# EAGLE design MainBoardR5 (EAGLE 6.5.0)
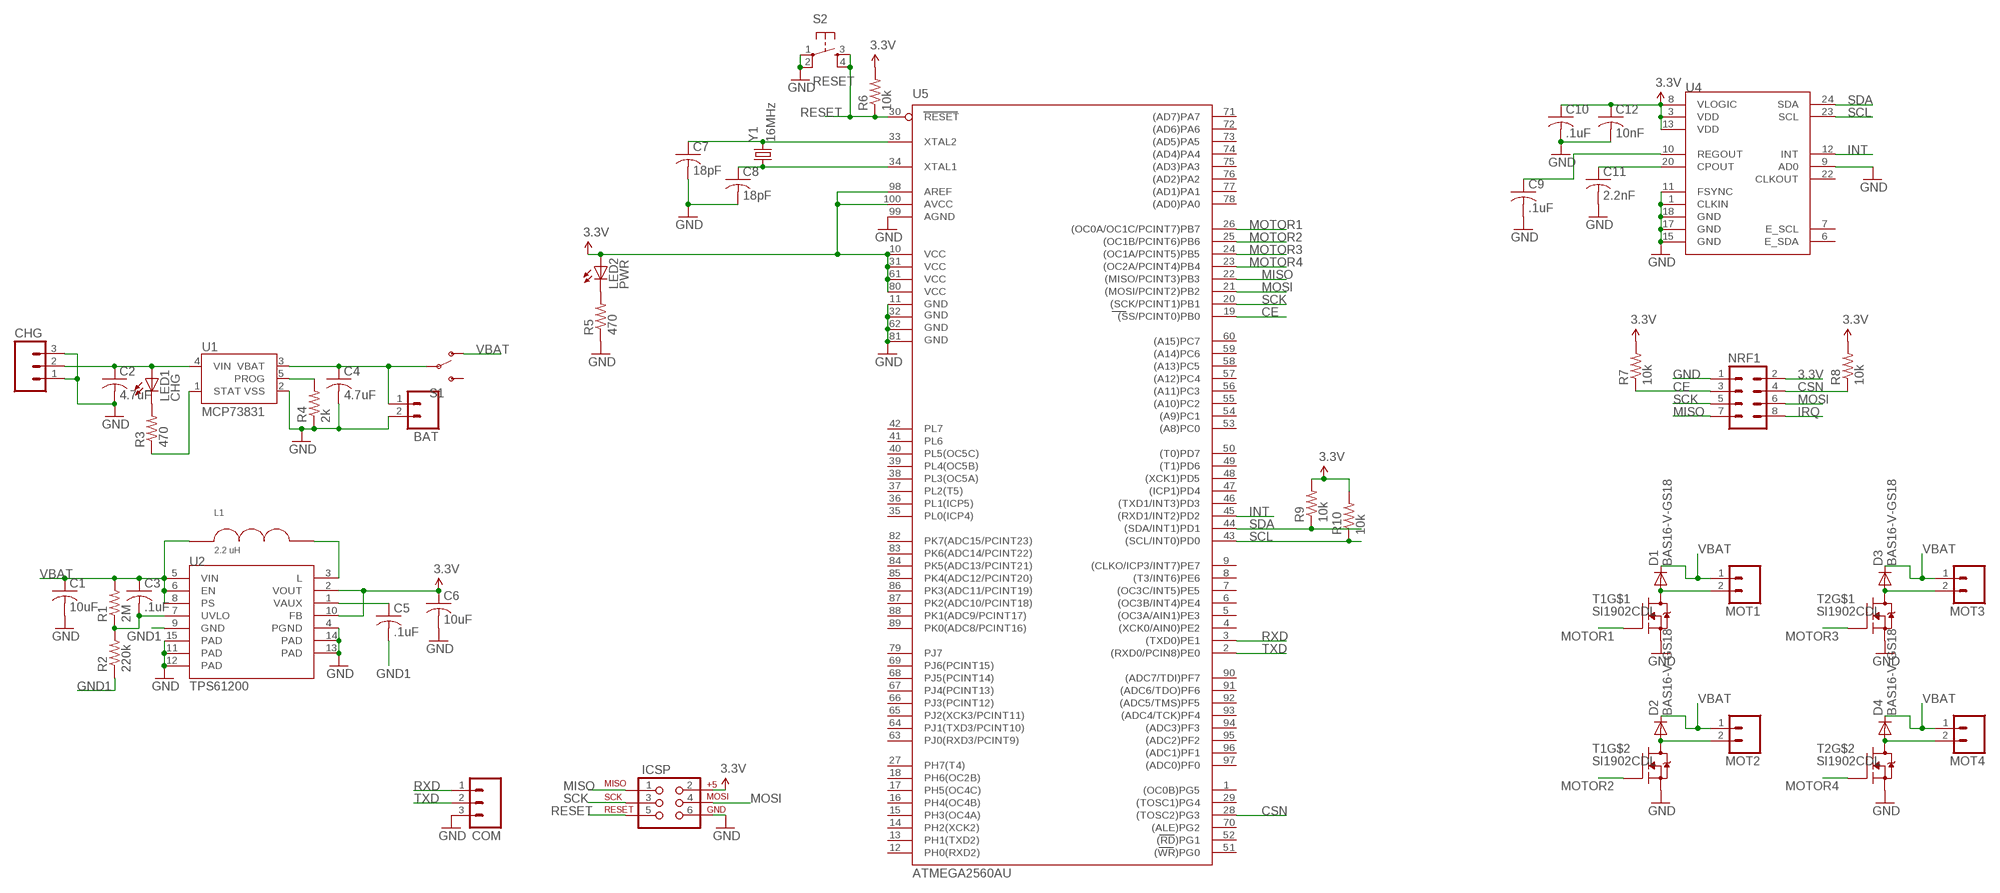
[diagram p0: schematic, sheet 1]

## Parts
BAT  M02LOCK_LONGPADS  [1X02_LOCK_LONGPADS]
C1  10uF  C-USC0805  [C0805]
C2  4.7uF  C-USC0805  [C0805]
C3  .1uF  C-USC0805  [C0805]
C4  4.7uF  C-USC0805  [C0805]
C5  .1uF  C-USC0805  [C0805]
C6  10uF  C-USC0805  [C0805]
C7  18pF  C-USC0805  [C0805]
C8  18pF  C-USC0805  [C0805]
C9  .1uF  C-USC0805  [C0805]
C10  .1uF  C-USC0805  [C0805]
C11  2.2nF  C-USC0805  [C0805]
C12  10nF  C-USC0805  [C0805]
CHG  M03LONGPADS  [1X03_LONGPADS]
COM  M03LONGPADS  [1X03_LONGPADS]
D1  BAS16-V-GS18  [SOT23]
D2  BAS16-V-GS18  [SOT23]
D3  BAS16-V-GS18  [SOT23]
D4  BAS16-V-GS18  [SOT23]
ICSP  AVR_SPI_PRG_62X3_LOCK  [2X3_LOCK]
L1  2.2 uH  BRHL2518T2R2M  [2518]
LED1  CHG  LED1206  [LED-1206]
LED2  PWR  LED1206  [LED-1206]
MOT1  M02LOCK_LONGPADS  [1X02_LOCK_LONGPADS]
MOT2  M02LOCK_LONGPADS  [1X02_LOCK_LONGPADS]
MOT3  M02LOCK_LONGPADS  [1X02_LOCK_LONGPADS]
MOT4  M02LOCK_LONGPADS  [1X02_LOCK_LONGPADS]
NRF1  M04X2  [2X4]
R1  2M  RESISTOR0805-RES  [0805]
R2  220k  RESISTOR0805-RES  [0805]
R3  470  RESISTOR0805-RES  [0805]
R4  2k  RESISTOR0805-RES  [0805]
R5  470  RESISTOR0805-RES  [0805]
R6  10k  RESISTOR0805-RES  [0805]
R7  10k  RESISTOR0805-RES  [0805]
R8  10k  RESISTOR0805-RES  [0805]
R9  10k  RESISTOR0805-RES  [0805]
R10  10k  RESISTOR0805-RES  [0805]
S1  SWITCH-SPST-SMD-A  [SWITCH-SPST-SMD-A]
S2  RESET  TAC_SWITCHSMD  [TACTILE_SWITCH_SMD]
T1  SI1902CDL  [SOT363_INFINEON]
T2  SI1902CDL  [SOT363_INFINEON]
U1  MCP73831  [SOT23-5]
U2  TPS61200  [QFN-10_PAD]
U4  MPU-9150QFN-24-NP  [QFN-24-NP]
U5  ATMEGA2560AU  [TQFP100]
Y1  16MHz  CRYSTAL5X3  [CRYSTAL-SMD-5X3]

## Nets
3.3V: C6.1 C10.1 C12.1 ICSP.2 LED2.A NRF1.2 R6.2 R7.2 R8.2 R9.2 R10.2 U2.2(VOUT) U2.10(FB) U4.3(VDD) U4.8(VLOGIC) U4.13(VDD) U5.10(VCC) U5.31(VCC1) U5.61(VCC2) U5.80(VCC3) U5.98(AREF) U5.100(AVCC)
BAT+: BAT.1 C4.1 S1.2(P) U1.3(VBAT)
CE: NRF1.3 R7.1 U5.19((SS/PCINT0)PB0)
CSN: NRF1.4 R8.1 U5.28((TOSC2)PG3)
GND: BAT.2 C1.2 C2.2 C4.2 C6.2 C7.2 C8.2 C9.2 C10.2 C11.2 C12.2 CHG.1 CHG.3 COM.3 ICSP.6 NRF1.1 R4.1 R5.1 S2.1 S2.2 T1.1(S) T1.4(S) T2.1(S) T2.4(S) U1.2(VSS) U2.4(PGND) U2.11(PAD) U2.12(PAD) U2.13(PAD) U2.14(PAD) U2.15(PAD) U4.1(CLKIN) U4.9(AD0) U4.11(FSYNC) U4.15(GND) U4.17(GND) U4.18(GND) U5.11(GND) U5.32(GND1) U5.62(GND2) U5.81(GND3) U5.99(AGND)
GND1: C5.2 R2.1 U2.9(GND)
INT: U4.12(INT) U5.45((RXD1/INT2)PD2)
IRQ: NRF1.8
MISO: ICSP.1 NRF1.7 U5.22((MISO/PCINT3)PB3)
MOSI: ICSP.4 NRF1.6 U5.21((MOSI/PCINT2)PB2)
MOT1-: D1.1(A) MOT1.2 T1.6(D)
MOT2-: D2.1(A) MOT2.2 T1.3(D)
MOT3-: D3.1(A) MOT3.2 T2.6(D)
MOT4-: D4.1(A) MOT4.2 T2.3(D)
MOTOR1: T1.2(G) U5.26((OC0A/OC1C/PCINT7)PB7)
MOTOR2: T1.5(G) U5.25((OC1B/PCINT6)PB6)
MOTOR3: T2.2(G) U5.24((OC1A/PCINT5)PB5)
MOTOR4: T2.5(G) U5.23((OC2A/PCINT4)PB4)
N$2: C7.1 U5.33(XTAL2) Y1.3
N$3: C8.1 U5.34(XTAL1) Y1.1
N$4: C11.1 U4.20(CPOUT)
N$5: LED1.C R3.2
N$9: C9.1 U4.10(REGOUT)
N$10: R3.1 U1.1(STAT)
N$12: R4.2 U1.5(PROG)
N$13: C5.1 U2.1(VAUX)
N$14: C3.2 R1.1 R2.2 U2.7(UVLO)
N$15: LED2.C R5.2
N$16: L1.P$2 U2.3(L)
RESET: ICSP.5 R6.1 S2.3 S2.4 U5.30(RESET)
RXD: COM.1 U5.3((TXD0)PE1)
SCK: ICSP.3 NRF1.5 U5.20((SCK/PCINT1)PB1)
SCL: R10.1 U4.23(SCL) U5.43((SCL/INT0)PD0)
SDA: R9.1 U4.24(SDA) U5.44((SDA/INT1)PD1)
TXD: COM.2 U5.2((RXD0/PCIN8)PE0)
VBAT: C1.1 C3.1 D1.3(C) D2.3(C) D3.3(C) D4.3(C) L1.P$1 MOT1.1 MOT2.1 MOT3.1 MOT4.1 R1.2 S1.1(O) U2.5(VIN) U2.6(EN) U2.8(PS)
VIN: C2.1 CHG.2 LED1.A U1.4(VIN)
Unconnected: S1.3(S) U4.6(E_SDA) U4.7(E_SCL) U4.22(CLKOUT) U5.1((OC0B)PG5) U5.4((XCK0/AIN0)PE2) U5.5((OC3A/AIN1)PE3) U5.6((OC3B/INT4)PE4) U5.7((OC3C/INT5)PE5) U5.8((T3/INT6)PE6) U5.9((CLKO/ICP3/INT7)PE7) U5.12(PH0(RXD2)) U5.13(PH1(TXD2)) U5.14(PH2(XCK2)) U5.15(PH3(OC4A)) U5.16(PH4(OC4B)) U5.17(PH5(OC4C)) U5.18(PH6(OC2B)) U5.27(PH7(T4)) U5.29((TOSC1)PG4) U5.35(PL0(ICP4)) U5.36(PL1(ICP5)) U5.37(PL2(T5)) U5.38(PL3(OC5A)) U5.39(PL4(OC5B)) U5.40(PL5(OC5C)) U5.41(PL6) U5.42(PL7) U5.46((TXD1/INT3)PD3) U5.47((ICP1)PD4) U5.48((XCK1)PD5) U5.49((T1)PD6) U5.50((T0)PD7) U5.51((WR)PG0) U5.52((RD)PG1) U5.53((A8)PC0) U5.54((A9)PC1) U5.55((A10)PC2) U5.56((A11)PC3) U5.57((A12)PC4) U5.58((A13)PC5) U5.59((A14)PC6) U5.60((A15)PC7) U5.63(PJ0(RXD3/PCINT9)) U5.64(PJ1(TXD3/PCINT10)) U5.65(PJ2(XCK3/PCINT11)) U5.66(PJ3(PCINT12)) U5.67(PJ4(PCINT13)) U5.68(PJ5(PCINT14)) U5.69(PJ6(PCINT15)) U5.70((ALE)PG2) U5.71((AD7)PA7) U5.72((AD6)PA6) U5.73((AD5)PA5) U5.74((AD4)PA4) U5.75((AD3)PA3) U5.76((AD2)PA2) U5.77((AD1)PA1) U5.78((AD0)PA0) U5.79(PJ7) U5.82(PK7(ADC15/PCINT23)) U5.83(PK6(ADC14/PCINT22)) U5.84(PK5(ADC13/PCINT21)) U5.85(PK4(ADC12/PCINT20)) U5.86(PK3(ADC11/PCINT19)) U5.87(PK2(ADC10/PCINT18)) U5.88(PK1(ADC9/PCINT17)) U5.89(PK0(ADC8/PCINT16)) U5.90((ADC7/TDI)PF7) U5.91((ADC6/TDO)PF6) U5.92((ADC5/TMS)PF5) U5.93((ADC4/TCK)PF4) U5.94((ADC3)PF3) U5.95((ADC2)PF2) U5.96((ADC1)PF1) U5.97((ADC0)PF0)

## Library data of the parts
BAT MOT1-MOT4 = SparkFun:M02: Header 2 Standard 2-pin 0.1" header. Use with straight break away headers (SKU : PRT-00116), right angle break away headers (PRT-00553), swiss pins (PRT-00743), machine pins (PRT-00117), and female headers (PRT-00115). Molex polarized connector foot print use with SKU : PRT-08233 with associated crimp pins and housings.
C1-C12 = rcl:C-US: CAPACITOR, American symbol
CHG COM = SparkFun:M03: Header 3 Standard 3-pin 0.1" header. Use with straight break away headers (SKU : PRT-00116), right angle break away headers (PRT-00553), swiss pins (PRT-00743), machine pins (PRT-00117), and female headers (PRT-00115). Molex polarized connector foot print use with SKU : PRT-08232 with associated crimp pins and housings.
D1-D4 = diode:BAS16-V-GS18
ICSP = SparkFun:AVR_SPI_PRG_6: AVR ISP 6 Pin This is the reduced ISP connector for AVR programming. Common on Arduino. This footprint will take up less PCB space and can be used with a 10-pin to 6-pin adapter such as SKU: BOB-08508
L1 = inductors:BRHL2518T2R2M
LED1 LED2 = SparkFun:LED: LEDs Standard schematic elements and footprints for 5mm, 3mm, 1206, and 0603 sized LEDs. 5mm - Spark Fun Electronics SKU : COM-00529 (and others)
NRF1 = SparkFun:M04X2
R1-R10 = SparkFun:RESISTOR: Resistor Basic schematic elements and footprints for 0603, 1206, and PTH resistors.
S1 = SparkFun:SWITCH-SPST: SPST Switch Simple slide switch. Spark Fun Electronics SKU : COM-00102
S2 = SparkFun:TAC_SWITCH: Momentary Switch Button commonly used for reset or general input. Spark Fun Electronics SKU : COM-00097
T1 T2 = transistor-fet:SI1902CDL
U1 = SparkFun:MCP73831: Microchip's MCP73831 Miniature single cell, fully integrated Li-Ion, Li-polymer charge management controller http://ww1.microchip.com/downloads/en/DeviceDoc/21984a.pdf
U2 = SparkFun:TPS61200: DC to DC Booster
U4 = SparkFun-Sensors:MPU-9150: 9DOF (3mag, 3accel, 3rotat). I2C interface.
U5 = SparkFun-DigitalIC:ATMEGA2560: Atmel 100-pin 8-bit uC 64/128/256 Kbytes FLASH 4 Kbytes EEPROM 8 Kbytes SRAM 86 General Purpose I/O pins 12-channels16-bit PWM 4 x Serial USARTs 16-channels 10-bit A/D
Y1 = SparkFun:CRYSTAL: Crystals Various standard crystals. Proven footprints. Spark Fun Electronics SKU : COM-00534

## Board
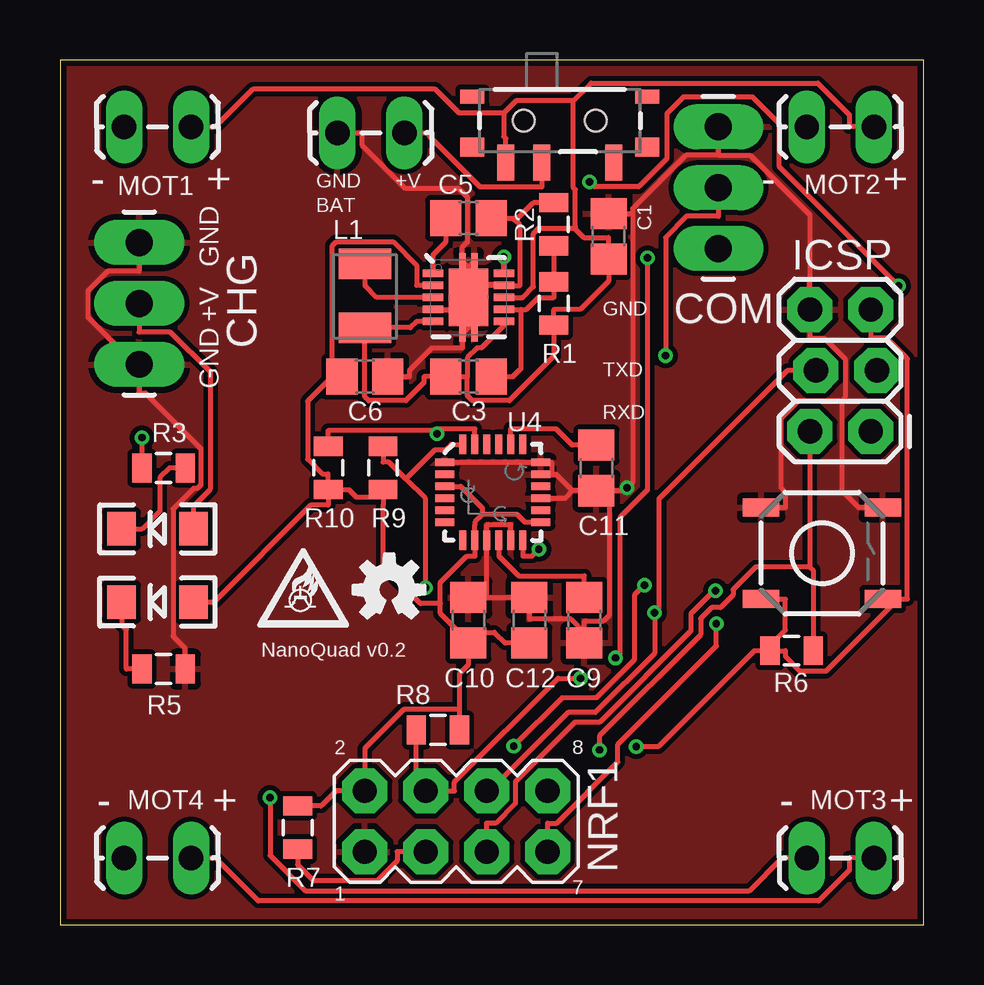
[diagram p1: board, top side]
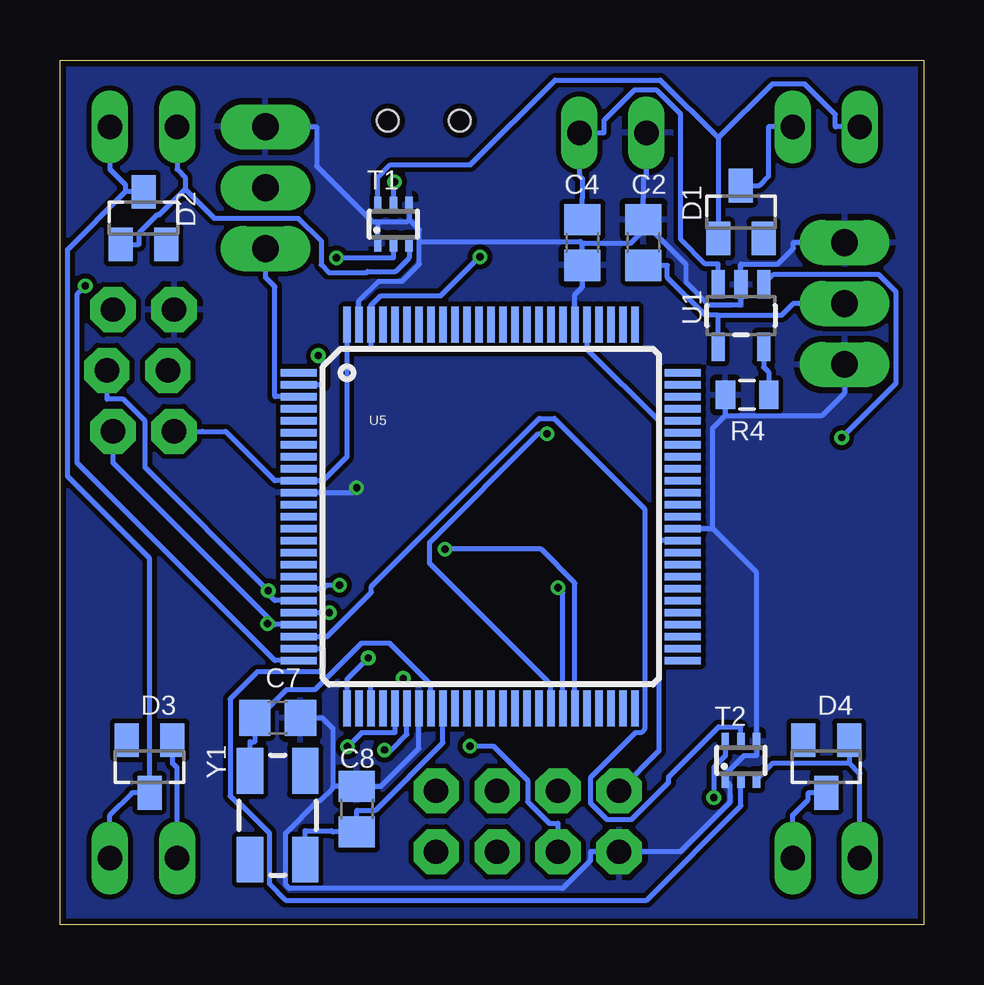
[diagram p2: board, bottom side, seen from below]

Size 35.99 x 36.06 mm. Coordinates in mm from the lower left corner, seen from the top.
Outline: 0,0 35.99,0 35.99,36.06 0,36.06 0,0
Copper layers (1*16): Top 0.035mm / dielectric 1.5mm / Bottom 0.035mm
Design rules "Fusion_eagle_rule_v1.1 *": minimum track width 8mil, minimum drill 12mil, track to track 8mil, track to pad 6mil, pad to pad 6mil, via to via 8mil, smd to smd 0mil, copper to edge 10mil, drill to drill 10mil, minimum pad ring 10mil, minimum via ring 6mil, stop-mask expansion 2mil, vias tented up to drill 100mil, thermal gap 10mil

### Footprints (pad centres in the part's own frame; a part is rotated, then mirrored left to right if it is on the bottom)
1X02_LOCK_LONGPADS = drill 1.016 long: 1 -0.127,0; 2 2.667,0
C0805 = smd 1.3 x 1.5: 1 -0.95,0; 2 0.95,0
1X03_LONGPADS = drill 1.118 pad 1.88 long: 1 0,0; 2 2.54,0; 3 5.08,0
SOT23 = smd 1 x 1.4: 1 -0.95,-1.1; 2 0.95,-1.1; 3 0,1.1
2X3_LOCK = drill 1.016 pad 1.88 octagon: 1 0,0; 2 0,2.54; 3 2.54,-0.254; 4 2.54,2.286; 5 5.08,0; 6 5.08,2.54
2518 = smd 1.27 x 2.184: P$1 -0.254,0; P$2 2.413,0
LED-1206 = smd 1.2 x 1.4: A -1.5,0; C 1.5,0
2X4 = drill 1.016 pad 1.88 octagon: 1 -3.81,-1.27; 2 -3.81,1.27; 3 -1.27,-1.27; 4 -1.27,1.27; 5 1.27,-1.27; 6 1.27,1.27; 7 3.81,-1.27; 8 3.81,1.27
0805 = smd 0.8 x 1.2: 1 -0.9,0; 2 0.9,0
SWITCH-SPST-SMD-A = smd 0.7 x 1.5: 1 -2.25,-1.75; 2 -0.75,-1.75; 3 2.25,-1.75 | smd 1 x 0.6: GND1 -3.65,1; GND3 3.65,1 | smd 1 x 0.8: GND2 -3.65,-1.1; GND4 3.65,-1.1 | hole 0.9: -1.5,0; 1.5,0
TACTILE_SWITCH_SMD = smd 1.524 x 0.762: 1 -2.54,1.905; 2 2.54,1.905; 3 -2.54,-1.905; 4 2.54,-1.905
SOT363_INFINEON = smd 0.3 x 0.7: 1 -0.65,-0.8; 2 0,-0.8; 3 0.65,-0.8; 4 0.65,0.8; 5 0,0.8; 6 -0.65,0.8
SOT23-5 = smd 0.55 x 1.2: 1 -0.95,-1.3; 2 0,-1.3; 3 0.95,-1.3; 4 0.95,1.3; 5 -0.95,1.3
QFN-10_PAD = smd 0.297 x 0.85: 1 -1,-1.475; 2 -0.5,-1.475; 3 0,-1.475; 4 0.5,-1.475; 5 1,-1.475; 6 1,1.475; 7 0.5,1.475; 8 0,1.475; 9 -0.5,1.475; 10 -1,1.475 | smd 0.7 x 0.28: 11 -1.5,0.25; 12 -1.5,-0.25; 13 1.5,0.25; 14 1.5,-0.25 | smd 2.4 x 1.65: 15 0,0
QFN-24-NP = smd 0.8 x 0.3: 1 -2,1.25; 2 -2,0.75; 3 -2,0.25; 4 -2,-0.25; 5 -2,-0.75; 6 -2,-1.25; 13 2,-1.25; 14 2,-0.75; 15 2,-0.25; 16 2,0.25; 17 2,0.75; 18 2,1.25 | smd 0.3 x 0.8: 7 -1.25,-2; 8 -0.75,-2; 9 -0.25,-2; 10 0.25,-2; 11 0.75,-2; 12 1.25,-2; 19 1.25,2; 20 0.75,2; 21 0.25,2; 22 -0.25,2; 23 -0.75,2; 24 -1.25,2
TQFP100 = smd 1.5 x 0.3: 1 -8,6; 2 -8,5.5; 3 -8,5; 4 -8,4.5; 5 -8,4; 6 -8,3.5; 7 -8,3; 8 -8,2.5; 9 -8,2; 10 -8,1.5; 11 -8,1; 12 -8,0.5; 13 -8,0; 14 -8,-0.5; 15 -8,-1; 16 -8,-1.5; 17 -8,-2; 18 -8,-2.5; 19 -8,-3; 20 -8,-3.5; 21 -8,-4; 22 -8,-4.5; 23 -8,-5; 24 -8,-5.5; 25 -8,-6; 51 8,-6; 52 8,-5.5; 53 8,-5; 54 8,-4.5; 55 8,-4; 56 8,-3.5; 57 8,-3; 58 8,-2.5; 59 8,-2; 60 8,-1.5; 61 8,-1; 62 8,-0.5; 63 8,0; 64 8,0.5; 65 8,1; 66 8,1.5; 67 8,2; 68 8,2.5; 69 8,3; 70 8,3.5; 71 8,4; 72 8,4.5; 73 8,5; 74 8,5.5; 75 8,6 | smd 0.3 x 1.5: 26 -6,-8; 27 -5.5,-8; 28 -5,-8; 29 -4.5,-8; 30 -4,-8; 31 -3.5,-8; 32 -3,-8; 33 -2.5,-8; 34 -2,-8; 35 -1.5,-8; 36 -1,-8; 37 -0.5,-8; 38 0,-8; 39 0.5,-8; 40 1,-8; 41 1.5,-8; 42 2,-8; 43 2.5,-8; 44 3,-8; 45 3.5,-8; 46 4,-8; 47 4.5,-8; 48 5,-8; 49 5.5,-8; 50 6,-8; 76 6,8; 77 5.5,8; 78 5,8; 79 4.5,8; 80 4,8; 81 3.5,8; 82 3,8; 83 2.5,8; 84 2,8; 85 1.5,8; 86 1,8; 87 0.5,8; 88 0,8; 89 -0.5,8; 90 -1,8; 91 -1.5,8; 92 -2,8; 93 -2.5,8; 94 -3,8; 95 -3.5,8; 96 -4,8; 97 -4.5,8; 98 -5,8; 99 -5.5,8; 100 -6,8
CRYSTAL-SMD-5X3 = smd 1.9 x 1.1: 1 -1.85,-1.15; 2 1.85,-1.15; 3 1.85,1.15; 4 -1.85,1.15

### Placement (x,y rotation side)
BAT  14.22,33.02 180 top
C1  22.86,28.7 90 top
C2  11.68,28.45 90 bottom
C3  17.02,22.86 0 top
C4  14.22,28.45 270 bottom
C5  17.02,29.46 0 top
C6  12.7,22.86 0 top
C7  26.92,8.64 0 bottom
C8  23.62,4.83 90 bottom
C9  21.84,12.7 270 top
C10  17.02,12.7 90 top
C11  22.35,19.05 270 top
C12  19.56,12.7 90 top
CHG  3.3,23.37 90 top
COM  27.43,28.19 90 top
D1  7.62,29.72 0 bottom
D2  32.51,29.46 0 bottom
D3  32.26,6.6 180 bottom
D4  4.06,6.6 180 bottom
ICSP  33.78,20.57 90 top
L1  12.7,25.15 90 top
LED1  4.06,16.51 180 top
LED2  4.06,13.46 180 top
MOT1  5.33,33.27 180 top
MOT2  33.78,33.27 180 top
MOT3  33.78,2.79 180 top
MOT4  5.33,2.79 180 top
NRF1  16.51,4.32 0 top
R1  20.57,25.91 270 top
R2  20.57,29.21 270 top
R3  4.32,19.05 0 top
R4  7.37,22.1 0 bottom
R5  4.32,10.67 180 top
R6  30.48,11.43 0 top
R7  9.91,4.06 90 top
R8  15.75,8.13 0 top
R9  13.46,19.05 270 top
R10  11.18,19.05 270 top
S1  20.83,33.53 0 top
S2  31.75,15.49 0 top
T1  22.1,29.21 0 bottom
T2  7.62,6.86 0 bottom
U1  7.62,25.4 180 bottom
U2  17.02,26.16 270 top
U4  18.03,18.03 0 top
U5  18.03,17.02 0 bottom
U$1  [BURNT_TRANSISTORS_XSM]  10.16,13.72 0 top
U$2  [OSHW-LOGO-S]  13.72,13.97 0 top
Y1  26.92,4.57 90 bottom

### Tracks (layer width: path | path; a pad name or v marks a point on that pad's centre or on a via)
3.3V  (via drill 0.3 pad 0.61)
  Top 0.203: U2.2 14.86,26.66 14.86,27.49 13.88,28.48 11.51,28.48 11.34,28.31 11.34,22.86 | 11.34,22.86 10.32,21.84 10.32,19.41 10.93,18.8 11.18,18.8 R10.2 | 11.34,22.86 11.38,22.86 C6.1 | 16.65,8.98 16.65,10.48 17.02,10.85 C10.1 17.02,12.2 | 16.65,8.98 14.31,8.98 12.7,7.37 NRF1.2 11.51,5.59 10.88,4.96 R7.2 | R10.2 12.03,18.15 12.36,17.82 13.46,17.82 | 13.46,17.82 13.46,17.5 13.46,14.95 15.01,13.39 15.85,13.39 | R9.2 13.46,17.82 | LED2.A 6.42,13.46 10.45,17.5 11.18,17.5 R10.2 | U2.10 v18.49,27.85 | 31.24,14.93 29,14.93 28.05,13.98 28.05,13.76 27.52,13.23 27.16,13.23 26.7,12.77 26.7,12.09 22.48,7.87 v22.48,7.29 | 15.85,13.39 15.85,14.28 16.95,15.38 17.28,15.38 U4.8 17.28,16.14 17.28,16.69 17.28,16.79 17.61,17.12 | 17.02,12.2 16.64,12.2 15.85,12.99 15.85,13.39 | 31.24,14.93 31.38,14.79 R6.2 | 31.24,14.93 31.24,19.38 ICSP.2 | U4.13 19.38,16.78 19.05,17.12 17.61,17.12 | C12.1 18.55,11.75 18.1,12.2 17.02,12.2 | R8.2 16.65,8.98 | U4.3 16.69,18.28 17.61,17.36 17.61,17.12
  Bottom 0.203: v18.49,27.85 20.12,26.23 22.63,26.23 23.03,25.82 U5.98 23.03,24.01 | 11.04,16.02 11.04,7.25 NRF1.2 | 11.04,16.02 10.94,16.02 U5.61 | 14.03,24.01 11.04,21.02 11.04,16.02 | 23.03,24.01 14.03,24.01 | U5.80 14.03,24.01 | 24.03,24.01 24.03,19.51 25.03,18.52 U5.10 27.04,18.52 29.09,20.57 30.05,20.57 ICSP.2 | 24.03,24.01 23.03,24.01 | U5.100 24.03,24.01 | v22.48,7.29 22.18,7.29 21.53,7.93 U5.31
BAT+
  Top 0.203: S1.2 20.08,30.77 17.5,30.77 15.37,32.9 15.37,33.02 BAT.1
  Bottom 0.203: U1.3 8.57,27.55 9.1,27.55 10.14,28.59 10.14,33.8 11.14,34.8 12.06,34.8 13.34,33.53 13.34,33.02 BAT.1 14.35,31.24 14.22,31.11 14.22,30.3 C4.1
CE  (via drill 0.3 pad 0.61)
  Top 0.203: R7.1 9.91,2.51 10.58,1.84 13.21,1.84 14.05,2.67 14.05,3.05 NRF1.3 | v24.35,14.17 23.93,13.75 23.93,11.05 22.35,9.47 20.92,9.47 v18.91,7.46
  Bottom 0.203: U5.19 25.03,14.02 24.88,14.17 v24.35,14.17 | NRF1.3 15.24,4.24 15.61,4.24 16.51,5.14 16.51,6.03 17.93,7.46 v18.91,7.46
CSN  (via drill 0.3 pad 0.61)
  Top 0.203: v21.69,10.28 20.75,10.28 16.43,5.96 16.43,5.59 15.57,5.59 | 15.57,5.59 14.85,6.32 R8.1 | NRF1.4 15.57,5.59
  Bottom 0.203: v21.69,10.28 21.95,10.02 23.03,10.02 U5.28
GND  (via drill 0.3 pad 0.61)
  Top 0.203: BAT.2 12.57,33.02 12.57,32.51 14.36,30.72 16.59,30.72 16.97,30.34 16.97,28.47 16.77,28.27 U2.12 17.02,27.41 | 17.78,13.65 18.55,13.65 C12.2 19.56,12.75 21.3,12.75 21.84,12.2 | 17.78,13.65 U4.9 17.78,16.69 18.78,16.69 U4.11 | 21.84,12.2 21.84,12.65 22.64,12.65 22.88,12.9 22.88,18.1 | C9.2 21.84,12.2 | C10.2 17.78,13.65 | 22.88,18.1 23.36,18.1 23.48,18.22 v23.63,18.22 23.86,18.46 23.86,29.65 | 22.88,18.1 C11.2 21.35,18.1 | 21.35,18.1 21.03,17.78 U4.15 | C6.2 14.55,22.86 14.55,23.11 15.5,24.06 16.77,24.06 U2.14 17.02,24.91 17.02,25.07 17.02,25.43 | R5.1 5.22,11.52 4.71,12.03 4.71,17.34 5.56,18.2 5.72,18.2 5.87,18.34 5.87,19.86 3.56,22.17 3.3,22.17 CHG.1 3.13,23.37 1.17,25.33 1.17,26.43 1.99,27.25 3.3,27.25 CHG.3 | S2.1 30.23,17.4 30.23,18.03 30.04,18.23 30.04,21.12 30.76,21.84 32.56,21.84 | 32.56,21.84 32.72,22 32.72,23.58 31.84,24.46 31.24,24.46 ICSP.6 31.24,26.85 | 32.56,21.84 32.56,18.11 33.27,17.4 S2.2 | 23.86,29.65 23.76,29.65 C1.2 | U4.1 U4.18 20.26,19.28 20.48,19.28 20.48,18.81 20.51,18.78 | 20.51,18.78 20.36,18.78 U4.17 | 20.51,18.78 20.69,18.78 20.69,18.76 21.35,18.1 | 27.43,32.08 28.77,32.08 31.24,29.61 31.24,26.85 | 31.24,26.85 | COM.3 27.43,32.08 | 27.43,32.08 26.08,32.08 23.86,29.86 23.86,29.65 | 17.02,27.41 17.02,27.26 U2.15 17.02,26.06 17.02,25.7 | U2.11 17.02,27.41 | U2.4 16.22,25.66 16.26,25.7 17.02,25.7 | 17.02,25.7 17.02,25.43 | U2.13 17.27,25.27 17.19,25.27 17.02,25.43
  Bottom 0.203: 21.02,28.49 21.02,28.98 21.45,29.41 | 21.02,28.49 21.02,27.55 21.74,26.84 22.72,26.84 23.53,26.02 U5.99 | 21.02,28.49 14.31,28.49 14.22,28.4 | 24.63,5.78 24.63,5.7 25.14,5.19 25.23,5.19 26.59,3.82 26.59,1.68 26.43,1.52 15.05,1.52 13.89,2.67 13.89,3.05 NRF1.1 10.14,3.05 8.09,5.1 8.09,5.88 T2.1 8.27,6.29 7.5,7.05 6.97,7.05 T2.4 6.97,14.69 8.8,16.52 | 24.63,5.78 C8.2 22.62,5.78 21.03,7.36 U5.32 | 24.63,5.78 24.63,8.19 25.07,8.64 C7.2 | 14.22,28.4 C4.2 14.22,26.59 14.53,26.28 U5.81 | 22.75,29.31 21.54,29.31 21.45,29.41 | 22.75,29.31 22.97,29.31 25.3,31.64 25.3,33.27 COM.3 | 22.75,29.31 22.75,29.01 T1.1 | T1.4 21.45,29.41 | 11.68,28.95 12.23,28.4 14.22,28.4 | 11.68,28.95 11.31,28.95 9.9,27.54 9.9,26.79 8.96,25.85 7.62,25.85 U1.2 7.62,27.55 6.08,27.55 5.44,28.2 5.44,28.45 CHG.3 | 11.68,28.95 C2.2 11.68,30.3 11.68,31.11 11.56,31.24 BAT.2 | CHG.1 3.3,22.17 4.23,21.24 8.27,21.24 | 8.27,21.24 8.27,21.35 R4.1 | 8.8,16.52 8.8,20.71 8.27,21.24 | 8.8,16.52 9.03,16.52 U5.62 | U5.11 23.84,18.02 v23.63,18.22
  pour Bottom: 0.25,36.07 35.81,36.07 35.81,0 0,0 0,36.07
  pour Top: 0,36.07 36.07,36.07 36.07,-0.25 0,-0.25
GND1
  Top 0.203: 18.97,29.36 18.87,29.46 C5.2 | 18.97,29.36 19.17,29.16 19.17,26.66 U2.9 | 18.97,29.36 19.72,30.11 R2.1
INT  (via drill 0.3 pad 0.61)
  Top 0.203: v19.95,15.66 19.67,15.38 19.28,15.38 U4.12
  Bottom 0.203: U5.45 14.53,14.25 15.95,15.66 v19.95,15.66
MISO  (via drill 0.3 pad 0.61)
  Top 0.203: NRF1.7 20.32,4.24 20.69,4.24 23.25,6.79 23.25,7.53 27.35,11.63 v27.35,12.56
  Bottom 0.203: 27.21,12.69 33.78,19.26 ICSP.1 | 27.21,12.69 27.04,12.52 U5.22 | v27.35,12.56 27.21,12.69
MOSI  (via drill 0.3 pad 0.61)
  Top 0.203: NRF1.6 17.9,5.59 21.17,8.86 22.31,8.86 24.77,11.32 v24.77,13.02 24.96,13.21 24.96,17.77 30.3,23.11 ICSP.4
  Bottom 0.203: v24.77,13.02 25.03,13.02 U5.21
MOT1-
  Bottom 0.203: MOT1.2 3.68,33.27 3.68,33.78 4.96,35.06 6.32,35.06 8.57,32.81 | 8.57,32.81 D1.1 | T1.6 22.75,31.16 22.23,31.68 18.89,31.68 15.36,35.22 10.98,35.22 8.57,32.81
MOT2-
  Bottom 0.203: 30.78,30.68 29.57,29.46 26.06,29.46 25.11,28.52 25.11,27.52 24.79,27.19 23.23,27.19 23.18,27.24 22.01,27.24 21.45,27.81 T1.3 | 30.78,30.68 31.85,29.61 31.93,29.61 32.71,28.84 32.71,28.36 D2.1 | 30.78,30.68 30.78,31.16 31.11,31.5 MOT2.2
MOT3-  (via drill 0.3 pad 0.61)
  Top 0.203: v8.75,5.3 8.75,2.9 10.22,1.43 28.74,1.43 30.1,2.79 MOT3.2
  Bottom 0.203: v8.75,5.3 8.75,6.57 8.27,7.05 T2.6 | MOT3.2 31.11,6.56 31.31,6.75 D3.1
MOT4-
  Bottom 0.203: T2.3 6.28,6.75 3.11,6.75 | D4.1 3.11,6.75 | MOT4.2 2.67,6.3 3.11,6.75
MOTOR1  (via drill 0.3 pad 0.61)
  Top 0.203: v24.48,27.81 24.48,18.13 23.32,16.98 23.32,11.31 v23.15,11.13
  Bottom 0.203: v23.15,11.13 24.03,10.24 U5.26 | v24.48,27.81 22.1,27.81 T1.2
MOTOR2  (via drill 0.3 pad 0.61)
  Top 0.203: v34.94,26.64 29.98,31.6 29.98,33.39 28.86,34.51 25.97,34.51 25.28,33.82 25.28,31.95 24.11,30.77 22.26,30.77 v22.06,30.98
  Bottom 0.203: U5.25 27.04,11.02 35.27,19.25 35.27,26.31 v34.94,26.64 | v22.06,30.98 22.1,30.94 T1.5
MOTOR3
  Bottom 0.203: U5.24 25.03,11.52 25.03,10.72 25.19,10.55 27.76,10.55 28.9,9.41 28.9,5.38 28.61,5.08 28.52,5.08 27.27,3.84 27.27,1.71 26.6,1.04 11.55,1.04 7.62,4.97 T2.2
MOTOR4
  Bottom 0.203: T2.5 7.62,8.26 8.55,8.26 10.63,6.18 10.63,5.93 12.17,4.39 13.2,4.39 13.89,5.08 13.89,6.14 12.02,8.01 11.78,8.01 11.63,8.16 11.63,17.35 15.39,21.11 16.02,21.11 23.02,14.11 23.02,13.86 24.87,12.02 U5.23
N$2
  Bottom 0.203: 27.87,8.44 27.87,8.49 26.57,9.8 25.37,9.8 23.43,11.74 22.25,11.74 20.53,10.02 U5.33 | 27.87,8.44 27.87,7.63 28.07,7.63 Y1.3 | C7.1 27.87,8.44
N$3
  Bottom 0.203: Y1.1 25.77,3.93 24.68,3.93 24.63,3.88 C8.1 23.62,4.78 22.84,4.78 20.03,7.59 U5.34
N$4
  Top 0.203: C11.1 21.35,20 20.66,20.69 18.78,20.69 U4.20
N$5
  Top 0.203: LED1.C 3.42,16.51 4.16,17.25 4.16,18.64 4.56,19.05 R3.2
N$9
  Top 0.203: C9.1 21.84,14.55 19.11,14.55 18.28,15.38 U4.10
N$10  (via drill 0.3 pad 0.61)
  Top 0.203: v3.42,20.32 3.42,19.9 R3.1
  Bottom 0.203: U1.1 6.25,27.12 1.89,27.12 1.17,26.4 1.17,22.57 v3.42,20.32
N$12
  Bottom 0.203: U1.5 6.67,23.25 6.47,23.04 R4.2
N$13
  Top 0.203: C5.1 16.07,28.46 15.54,27.93 U2.1
N$14
  Top 0.203: C3.2 18.87,22.86 19.2,23.19 19.2,25.66 | 19.2,25.66 19.43,25.66 19.92,26.15 20.57,26.15 R1.1 R2.2 | U2.7 19.2,25.66
N$15
  Top 0.203: LED2.C 2.56,12.51 2.76,12.31 2.76,10.67 R5.2
N$16
  Top 0.203: L1.P$2 12.7,26.67 13.21,26.16 U2.3
N$17
  Top 0.254: 18.29,26.67 17.53,26.67
RESET  (via drill 0.3 pad 0.61)
  Top 0.203: v24.01,7.43 24.92,7.43 28.93,11.43 29.38,11.43 | 34.8,13.59 34.8,13.46 31.91,10.58 30.84,10.58 30.23,11.19 30.23,11.43 R6.1 29.38,11.43 | 34.8,13.59 35.31,13.59 35.31,23.61 34.45,24.46 33.78,24.46 ICSP.5 | S2.4 34.8,13.59 | S2.3 30.23,13.59 30.23,12.28 29.38,11.43
  Bottom 0.203: v24.01,7.43 23.42,8.01 22.03,8.01 U5.30
RXD
  Bottom 0.203: COM.1 27.43,27 27.04,26.61 27.04,22.02 U5.3
SCK  (via drill 0.3 pad 0.61)
  Top 0.203: v27.32,13.93 27.25,13.93 26.29,12.97 26.29,12.26 22.48,8.45 21.45,8.45 18.97,5.97 18.97,5.06 18.15,4.24 17.78,4.24 NRF1.5
  Bottom 0.203: ICSP.3 34.04,21.92 33.37,21.92 32.45,21 32.45,19.06 v27.32,13.93 27.32,13.8 27.04,13.52 U5.20
SCL  (via drill 0.3 pad 0.61)
  Top 0.203: 15.7,20.6 15.79,20.69 17.28,20.69 U4.23 | v15.7,20.48 15.7,20.6 | 15.7,20.6 11.18,20.6 R10.1
  Bottom 0.203: U5.43 15.53,10.02 20.59,15.07 20.59,15.95 16.06,20.48 v15.7,20.48
SDA  (via drill 0.3 pad 0.61)
  Top 0.203: 14.41,18.59 15.63,19.81 16.07,19.81 16.29,20.03 U4.24 | R9.1 13.46,19.3 13.71,19.3 14.41,18.59 | v15.24,14.06 15.24,17.77 14.41,18.59
  Bottom 0.203: v15.24,14.06 15.03,13.85 15.03,10.02 U5.44
TXD  (via drill 0.3 pad 0.61)
  Top 0.203: v25.23,23.73 25.23,28.67 26.1,29.54 27.43,29.54 COM.2
  Bottom 0.203: v25.23,23.73 25.03,23.53 25.03,22.52 U5.2
VBAT
  Top 0.203: 18.49,33.84 18.49,32.87 18.58,32.78 S1.1 | 21.39,34.37 19.01,34.37 18.49,33.84 | 18.49,33.84 16.64,33.84 15.64,34.84 8.04,34.84 6.48,33.27 MOT1.1 | 21.39,34.37 22.12,35.1 31.58,35.1 32.89,33.78 32.89,33.27 MOT2.1 | 21.43,29.05 21.47,29.09 21.47,30.65 21.39,30.73 21.39,34.37 | 21.43,29.05 21.82,28.66 22.86,28.66 C1.1 22.86,26.85 21.67,25.66 20.57,25.66 20.57,25.23 R1.2 20.57,23.7 18.73,21.86 17.18,21.86 16.97,22.06 16.97,22.86 | U2.8 19.28,26.16 19.72,26.6 19.72,28.82 19.96,29.05 21.43,29.05 | 16.97,22.86 C3.1 15.16,22.86 15.16,22.61 14.41,21.86 12.86,21.86 12.7,22.01 L1.P$1 14.59,24.89 14.86,25.16 U2.5 | U2.6 18.49,24.99 17.56,24.06 17.38,24.06 16.97,23.65 16.97,22.86 | MOT4.1 6.48,2.79 8.27,1 31.61,1 32.89,2.29 32.89,2.79 MOT3.1
  Bottom 0.203: MOT3.1 33.91,4.57 33.01,5.47 33.01,5.5 D3.3 32.26,15.28 35.68,18.7 35.68,28.15 33.27,30.56 | D4.3 4.82,5.5 4.82,5.21 5.46,4.57 MOT4.1 | D2.3 33.27,30.56 | MOT2.1 33.91,31.5 33.27,30.85 33.27,30.56 | D1.3 6.87,30.82 6.48,31.21 6.48,33.27 MOT1.1
VIN
  Top 0.203: LED1.A 5.56,17.46 5.57,17.46 6.28,18.18 6.28,23.04 4.6,24.71 3.3,24.71 CHG.2
  Bottom 0.203: 8.57,25.41 9.1,25.41 10.68,27 10.68,27.5 C2.1 | 8.57,25.41 5.93,25.41 5.44,25.91 CHG.2 | 8.57,25.41 8.57,24.78 U1.4

### Text on the board
tPlace: GND | +V | - | + | - | + | GND | +V | GND | TXD | GND | RXD | NanoQuad v0.2 | 2 | 8 | - | + | - | + | 1 | 7